# EasyEDA schematic PowerWall_2020-05-24_01-53-03.json
TITLE: Sheet_1; REV: 1.0; Date: 2020-05-23; Sheet: 1/1; Drawn By: karunadheera; Company: Your Company
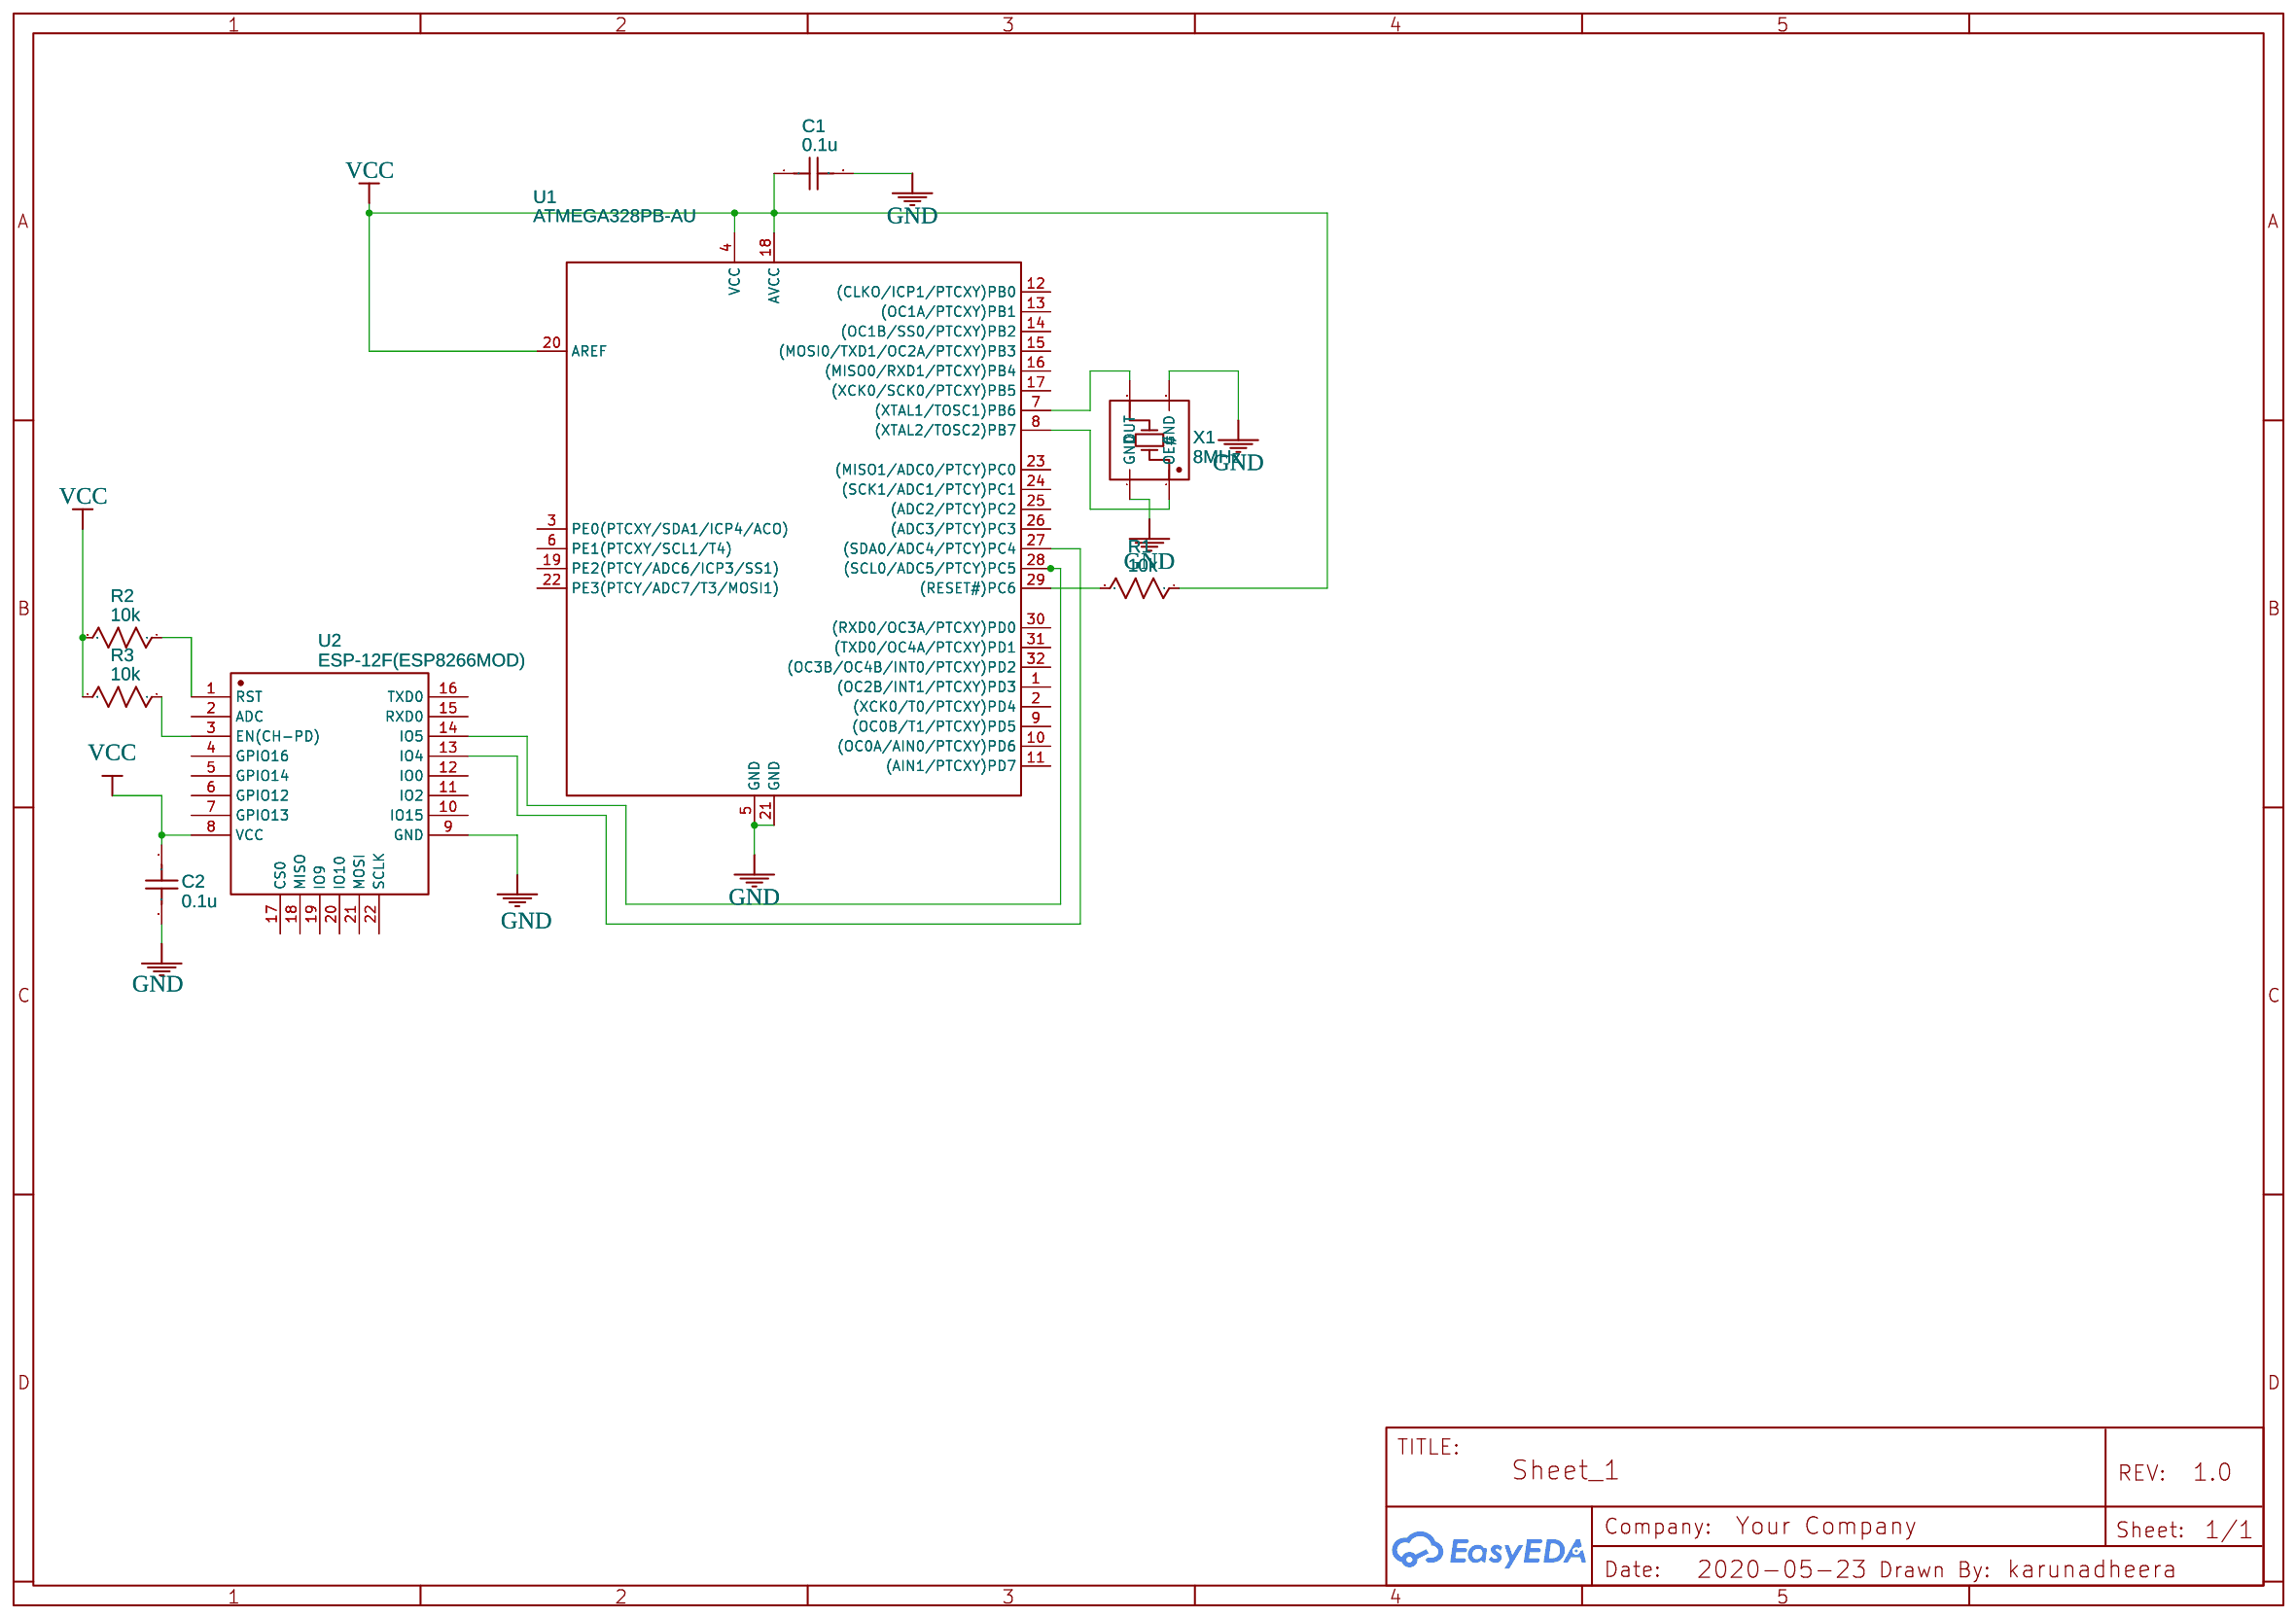
[diagram p0: schematic sheet]

## Parts
C1  0.1u  [C0402]
C2  0.1u  [C0402]
R1  10k  [R0201]
R2  10k  [R0201]
R3  10k  [R0201]
U1  ATMEGA328PB-AU  [TQFP-32_L7.0-W7.0-P0.80-LS9.0-BL]
U2  ESP-12F(ESP8266MOD)  [WIFIM-SMD_ESP-12F-ESP8266MOD]
X1  8MHz  [OSC-SMD_4P-L3.2-W2.5-BL]

## Library data of the parts
C1 C2 = C_0603_US: Contributor: LCEDA_Lib
R1-R3 = R_0201_US: Supplier Part: C98100; Supplier: LCSC; Contributor: LCEDA_Lib; Manufacturer Part: NCP15XW222J03RC; Package Display: No; Manufacturer: MuRata
U1 = ATMEGA328PB-AU: Supplier: LCSC; Manufacturer: MICROCHIP; Contributor: LCSC; Supplier Part: C132230; LCSC Assembly: Yes; SMT Type: Extend
U2 = ESP-12F(ESP8266MOD): Supplier: LCSC; Manufacturer: Ai-Thinker; Supplier Part: C82891
X1 = XXDCELNANF-8MHZ: Supplier: LCSC; Supplier Part: C367183; Manufacturer: TAITIEN Elec; Contributor: LCSC; LCSC Assembly: Yes; SMT Type: Extend

## Nets
GND: C1.2 C2.2 U1.5(GND) U1.21(GND) U2.9(GND) X1.2(GND) X1.4(GND)
VCC: C1.1 C2.1 R1.1 R2.2 R3.2 U1.4(VCC) U1.18(AVCC) U1.20(AREF) U2.8(VCC)
Net-(R1-2): R1.2 U1.29((RESET#)PC6)
Net-(R2-1): R2.1 U2.1(RST)
Net-(R3-1): R3.1 U2.3(EN(CH-PD))
Net-(U1-7): U1.7((XTAL1/TOSC1)PB6) X1.3(OUT)
Net-(U1-8): U1.8((XTAL2/TOSC2)PB7) X1.1(OE#)
Net-(U1-27): U1.27((SDA0/ADC4/PTCY)PC4) U2.13(IO4)
Net-(U1-28): U1.28((SCL0/ADC5/PTCY)PC5) U2.14(IO5)

Not connected (* = marked no-connect by the designer): U1 1((OC2B/INT1/PTCXY)PD3) 2((XCK0/T0/PTCXY)PD4) 3(PE0(PTCXY/SDA1/ICP4/ACO)) 6(PE1(PTCXY/SCL1/T4)) 9((OC0B/T1/PTCXY)PD5) 10((OC0A/AIN0/PTCXY)PD6) 11((AIN1/PTCXY)PD7) 12((CLKO/ICP1/PTCXY)PB0) 13((OC1A/PTCXY)PB1) 14((OC1B/SS0/PTCXY)PB2) 15((MOSI0/TXD1/OC2A/PTCXY)PB3) 16((MISO0/RXD1/PTCXY)PB4) 17((XCK0/SCK0/PTCXY)PB5) 19(PE2(PTCY/ADC6/ICP3/SS1)) 22(PE3(PTCY/ADC7/T3/MOSI1)) 23((MISO1/ADC0/PTCY)PC0) 24((SCK1/ADC1/PTCY)PC1) 25((ADC2/PTCY)PC2) 26((ADC3/PTCY)PC3) 30((RXD0/OC3A/PTCXY)PD0) 31((TXD0/OC4A/PTCXY)PD1) 32((OC3B/OC4B/INT0/PTCXY)PD2); U2 2(ADC) 4(GPIO16) 5(GPIO14) 6(GPIO12) 7(GPIO13) 10(IO15) 11(IO2) 12(IO0) 15(RXD0) 16(TXD0) 17(CS0) 18(MISO) 19(IO9) 20(IO10) 21(MOSI) 22(SCLK)
